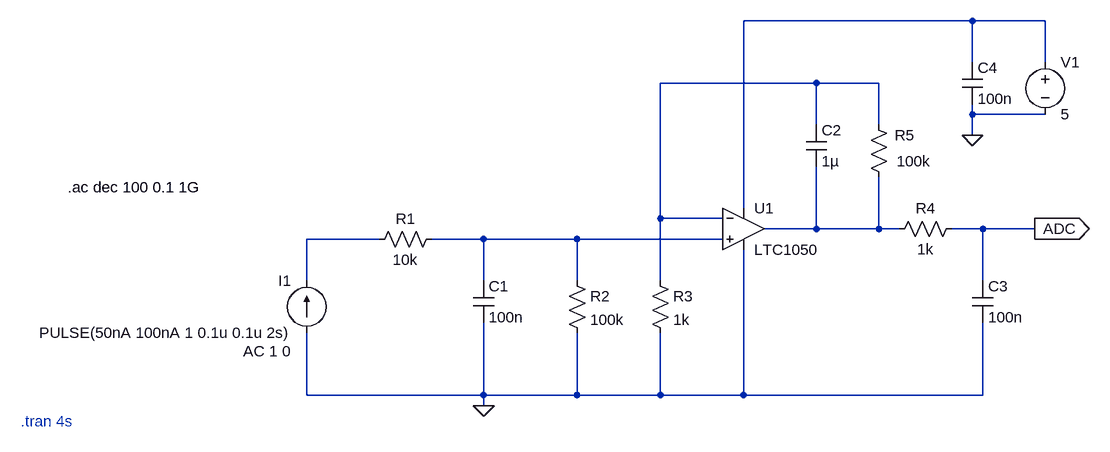
[diagram p0: schematic LTspice_drawing.asc]
LTspice_drawing.asc, the LTspice schematic file:
Version 4
SHEET 1 1276 680
WIRE 1072 -160 720 -160
WIRE 1184 -160 1072 -160
WIRE 1072 -96 1072 -160
WIRE 1184 -96 1184 -160
WIRE 832 -64 592 -64
WIRE 928 -64 832 -64
WIRE 1072 -16 1072 -32
WIRE 1184 -16 1072 -16
WIRE 832 0 832 -64
WIRE 928 0 928 -64
WIRE 1072 16 1072 -16
WIRE 720 128 720 -160
WIRE 592 144 592 -64
WIRE 688 144 592 144
WIRE 832 160 832 64
WIRE 832 160 752 160
WIRE 928 160 928 80
WIRE 928 160 832 160
WIRE 960 160 928 160
WIRE 1088 160 1040 160
WIRE 1168 160 1088 160
WIRE 160 176 48 176
WIRE 320 176 240 176
WIRE 464 176 320 176
WIRE 688 176 464 176
WIRE 48 240 48 176
WIRE 320 240 320 176
WIRE 464 240 464 176
WIRE 592 240 592 144
WIRE 1088 240 1088 160
WIRE 48 416 48 320
WIRE 320 416 320 304
WIRE 320 416 48 416
WIRE 464 416 464 320
WIRE 464 416 320 416
WIRE 592 416 592 320
WIRE 592 416 464 416
WIRE 720 416 720 192
WIRE 720 416 592 416
WIRE 1088 416 1088 304
WIRE 1088 416 720 416
WIRE 320 432 320 416
FLAG 320 432 0
FLAG 1072 16 0
FLAG 1168 160 ADC
IOPIN 1168 160 Out
SYMBOL res 256 160 R90
WINDOW 0 0 56 VBottom 2
WINDOW 3 32 56 VTop 2
SYMATTR InstName R1
SYMATTR Value 10k
SYMBOL cap 304 240 R0
SYMATTR InstName C1
SYMATTR Value 100n
SYMBOL res 448 224 R0
SYMATTR InstName R2
SYMATTR Value 100k
SYMBOL res 576 224 R0
SYMATTR InstName R3
SYMATTR Value 1k
SYMBOL OpAmps\\LTC1050 720 96 R0
SYMATTR InstName U1
SYMBOL current 48 320 R180
WINDOW 0 24 80 Left 2
WINDOW 3 24 0 Left 2
WINDOW 123 24 -28 Left 2
WINDOW 39 0 0 Left 0
SYMATTR InstName I1
SYMATTR Value PULSE(50nA 100nA 1 0.1u 0.1u 2s)
SYMATTR Value2 AC 1 0
SYMBOL cap 816 0 R0
SYMATTR InstName C2
SYMATTR Value 1µ
SYMBOL cap 1072 240 R0
SYMATTR InstName C3
SYMATTR Value 100n
SYMBOL cap 1056 -96 R0
SYMATTR InstName C4
SYMATTR Value 100n
SYMBOL res 1056 144 R90
WINDOW 0 0 56 VBottom 2
WINDOW 3 32 56 VTop 2
SYMATTR InstName R4
SYMATTR Value 1k
SYMBOL res 944 96 R180
WINDOW 0 -39 80 Left 2
WINDOW 3 -64 40 Left 2
SYMATTR InstName R5
SYMATTR Value 100k
SYMBOL voltage 1184 -112 R0
WINDOW 123 0 0 Left 0
WINDOW 39 0 0 Left 0
SYMATTR InstName V1
SYMATTR Value 5
TEXT -392 456 Left 2 ;.tran 4s
TEXT -320 96 Left 2 !.ac dec 100 0.1 1G

The netlist it stands for:
* LTspice_drawing.asc
R1 N005 N004 10k
C1 N005 0 100n
R2 N005 0 100k
R3 N002 0 1k
XU1 N005 N002 N001 0 N003 LTC1050  ; pins In+ In- V+ V- OUT
I1 0 N004 PULSE(50nA 100nA 1 0.1u 0.1u 2s) AC 1 0
C2 N002 N003 1µ
C3 ADC 0 100n
C4 N001 0 100n
R4 ADC N003 1k
R5 N003 N002 100k
V1 N001 0 5
* .tran 4s
.ac dec 100 0.1 1G
.lib LTC.lib
.backanno
.end